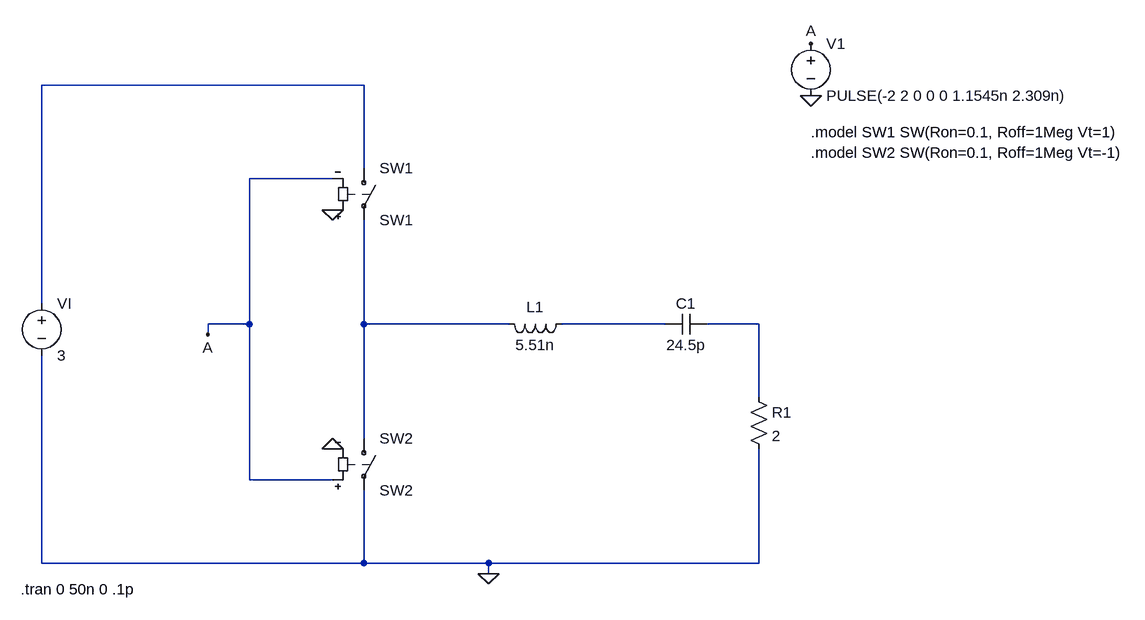
[diagram p0: schematic ClaseD FET (Problema 1).asc]
ClaseD FET (Problema 1).asc, the LTspice schematic file:
Version 4
SHEET 1 880 680
WIRE -832 -656 -1328 -656
WIRE -832 -528 -832 -656
WIRE -880 -512 -1008 -512
WIRE -1328 -320 -1328 -656
WIRE -1008 -288 -1008 -512
WIRE -1008 -288 -1072 -288
WIRE -832 -288 -832 -448
WIRE -608 -288 -832 -288
WIRE -368 -288 -528 -288
WIRE -224 -288 -304 -288
WIRE -1072 -272 -1072 -288
WIRE -224 -176 -224 -288
WIRE -832 -112 -832 -288
WIRE -1008 -48 -1008 -288
WIRE -880 -48 -1008 -48
WIRE -1328 80 -1328 -240
WIRE -832 80 -832 -32
WIRE -832 80 -1328 80
WIRE -640 80 -832 80
WIRE -224 80 -224 -96
WIRE -224 80 -640 80
WIRE -640 96 -640 80
FLAG -144 -640 0
FLAG -144 -720 A
FLAG -640 96 0
FLAG -880 -464 0
FLAG -880 -96 0
FLAG -1072 -272 A
SYMBOL res -240 -192 R0
SYMATTR InstName R1
SYMATTR Value 2
SYMBOL cap -304 -304 R90
WINDOW 0 0 32 VBottom 2
WINDOW 3 32 32 VTop 2
SYMATTR InstName C1
SYMATTR Value 24.5p
SYMBOL ind -512 -304 R90
WINDOW 0 5 56 VBottom 2
WINDOW 3 32 56 VTop 2
SYMATTR InstName L1
SYMATTR Value 5.51n
SYMATTR SpiceLine Rser=0.1
SYMBOL sw -832 -128 R0
SYMATTR InstName SW2
SYMATTR Value SW2
SYMBOL sw -832 -544 R0
SYMATTR InstName SW1
SYMATTR Value SW1
SYMBOL voltage -1328 -336 R0
SYMATTR InstName VI
SYMATTR Value 3
SYMBOL voltage -144 -736 R0
WINDOW 123 0 0 Left 0
WINDOW 39 0 0 Left 0
SYMATTR InstName V1
SYMATTR Value PULSE(-2 2 0 0 0 1.1545n 2.309n)
TEXT -144 -584 Left 2 !.model SW1 SW(Ron=0.1, Roff=1Meg Vt=1)
TEXT -1360 120 Left 2 !.tran 0 50n 0 .1p
TEXT -144 -552 Left 2 !.model SW2 SW(Ron=0.1, Roff=1Meg Vt=-1)

The netlist it stands for:
* ClaseD FET (Problema 1).asc
R1 N004 0 2
C1 N004 N003 24.5p
L1 N003 N002 5.51n Rser=0.1
SW2 N002 0 A 0 SW2
SW1 N001 N002 0 A SW1
VI N001 0 3
V1 A 0 PULSE(-2 2 0 0 0 1.1545n 2.309n)
.model SW1 SW(Ron=0.1, Roff=1Meg Vt=1)
.tran 0 50n 0 .1p
.model SW2 SW(Ron=0.1, Roff=1Meg Vt=-1)
.backanno
.end